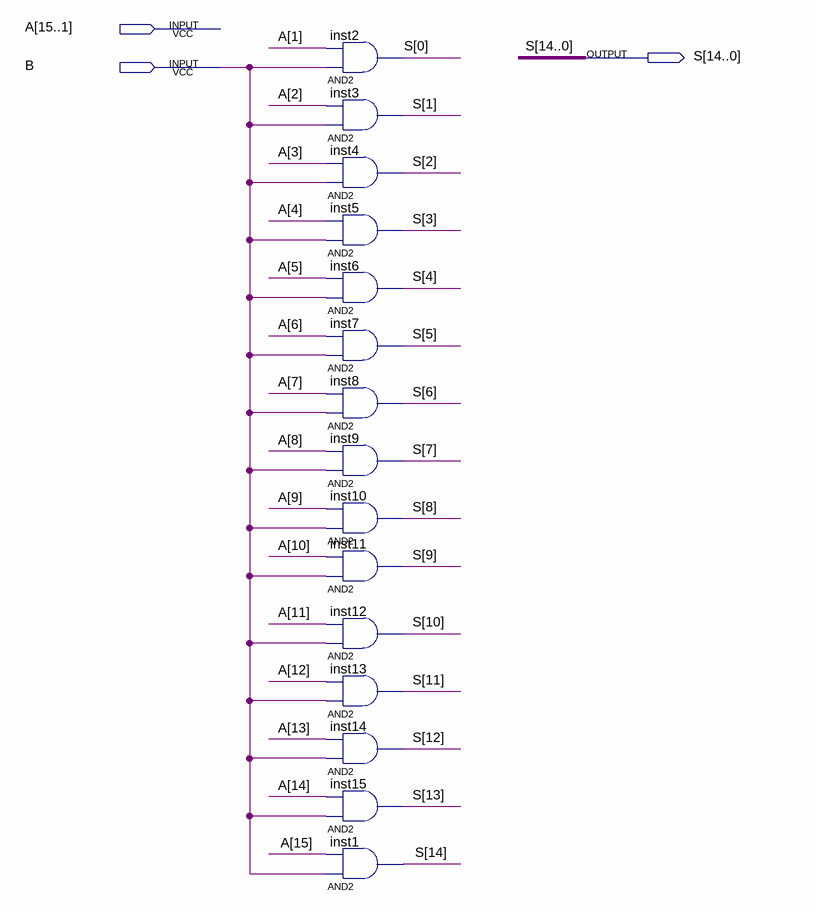
[diagram p0: schematic sheet]
// Quartus schematic AND15_1bit.bdf as structural Verilog: 15 symbols, 3 pins
module AND15_1bit (
  input  [15:1] A,
  input  B,
  output [14:0] S
);

  and inst2 (S[0], B, A[1]);
  and inst3 (S[1], B, A[2]);
  and inst4 (S[2], B, A[3]);
  and inst5 (S[3], B, A[4]);
  and inst6 (S[4], B, A[5]);
  and inst7 (S[5], B, A[6]);
  and inst8 (S[6], B, A[7]);
  and inst9 (S[7], B, A[8]);
  and inst10 (S[8], B, A[9]);
  and inst11 (S[9], B, A[10]);
  and inst12 (S[10], B, A[11]);
  and inst13 (S[11], B, A[12]);
  and inst14 (S[12], B, A[13]);
  and inst15 (S[13], B, A[14]);
  and inst1 (S[14], B, A[15]);
endmodule
